# Altium schematic sheet sar20-afbr-s50-array-board.SchDoc
size A3; SheetNumber: 1; SheetTotal: 1
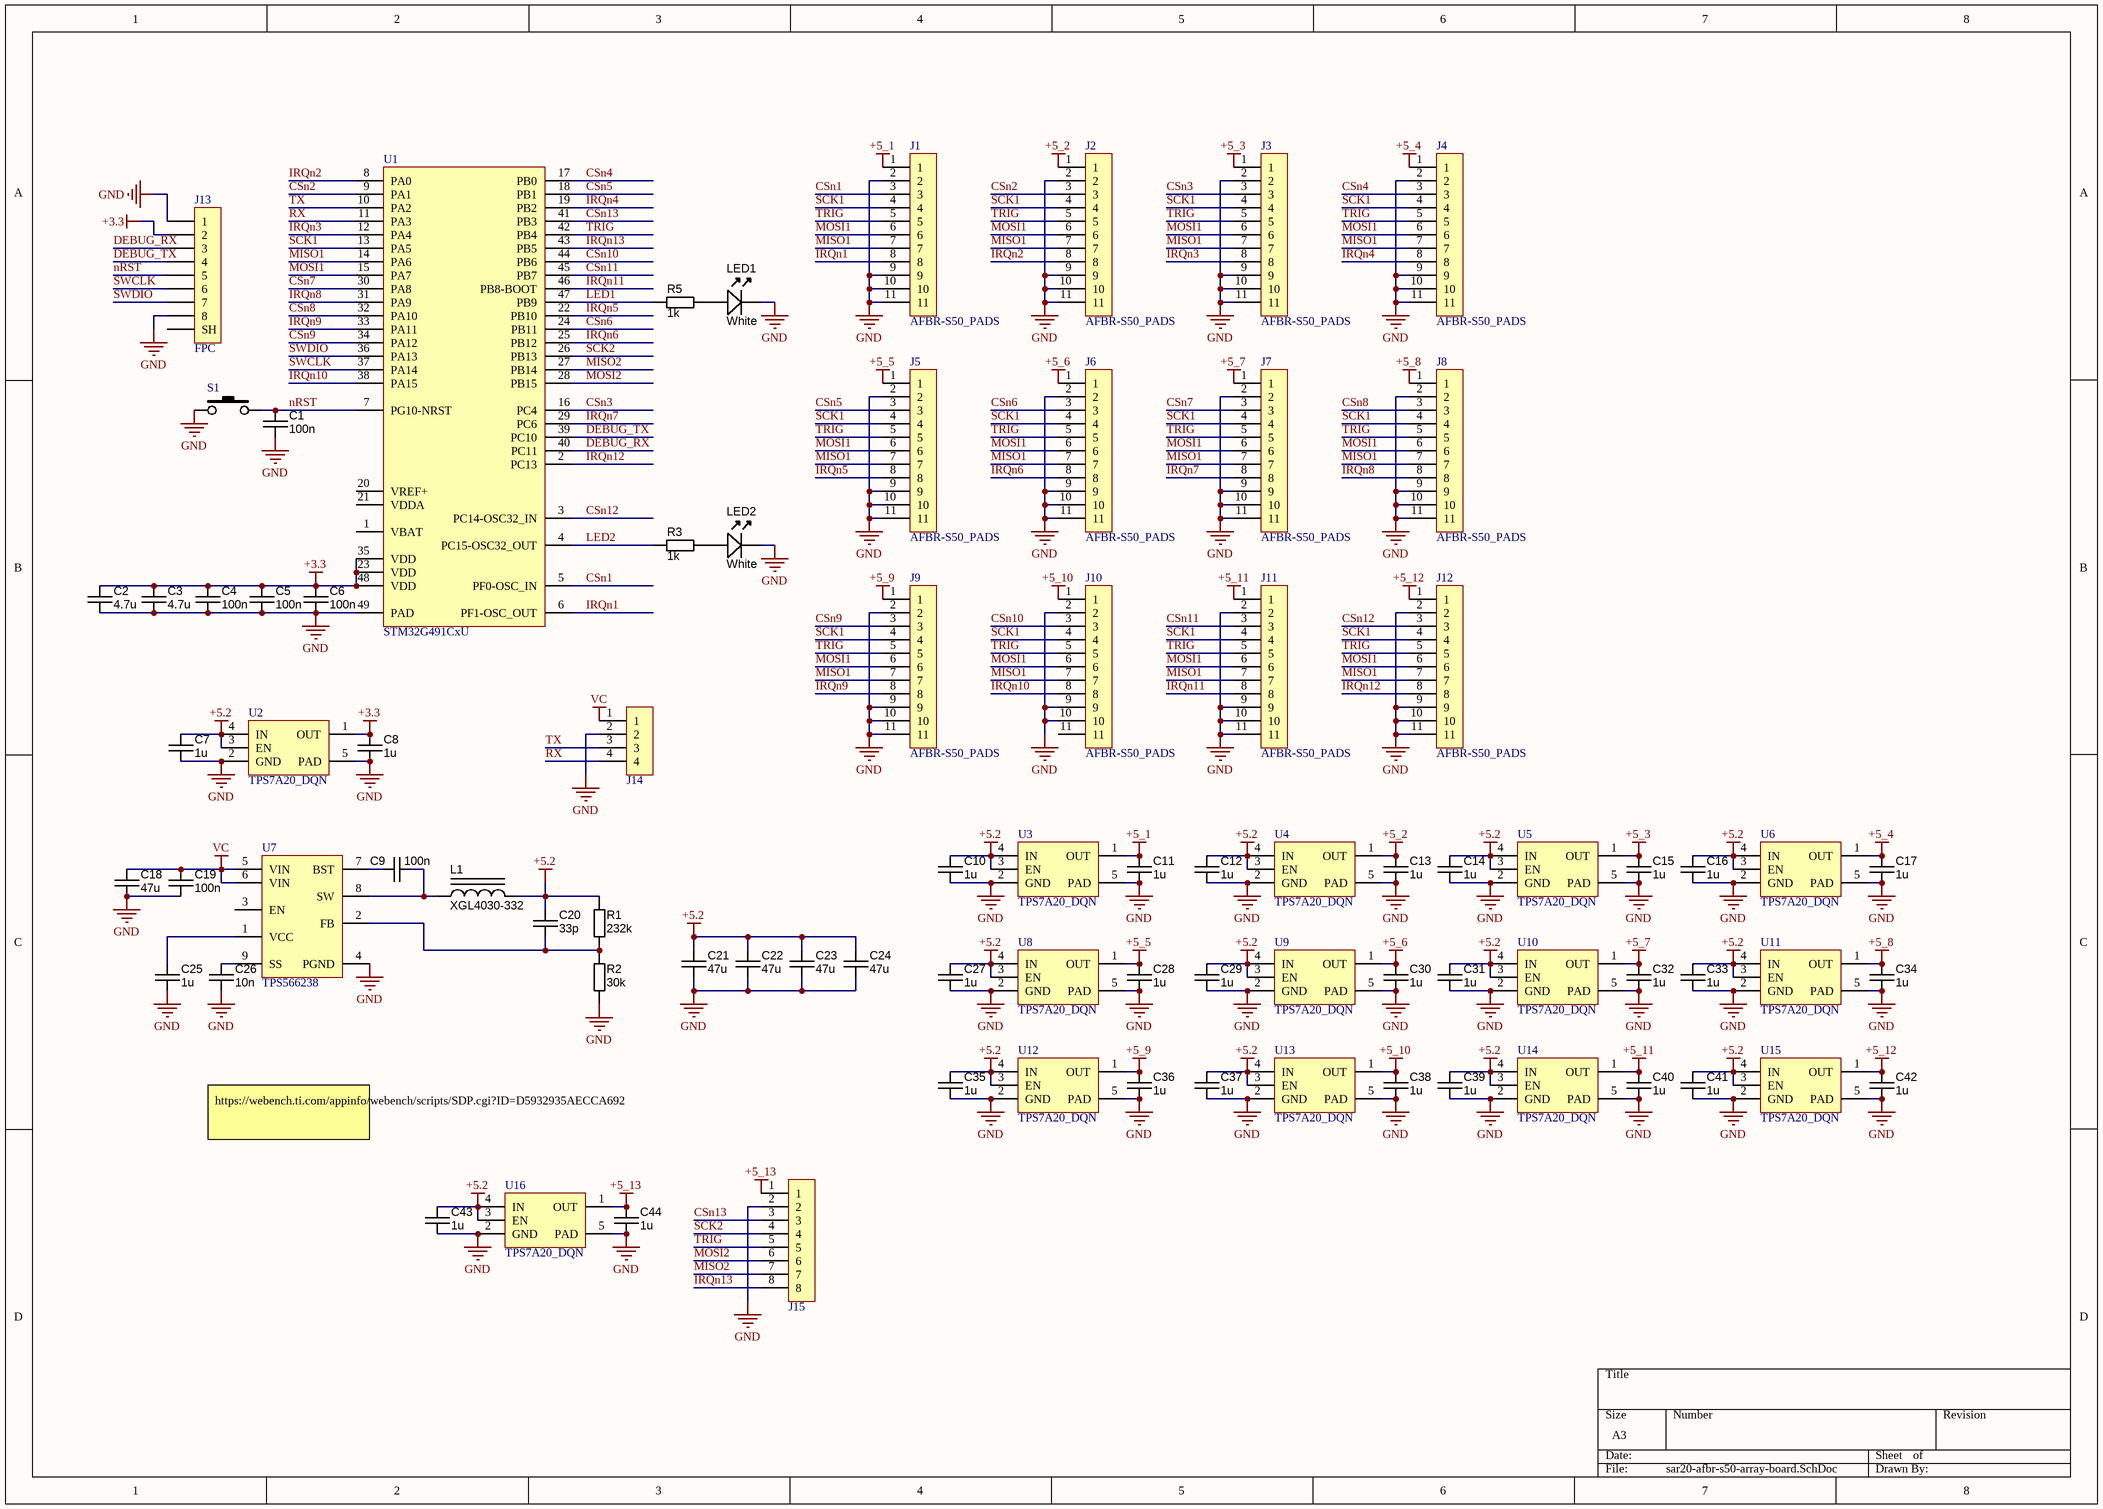
[diagram p0: sar20-afbr-s50-array-board.SchDoc]

## Parts
C1  value 100n  [CAPC0603X04N]  (hidden comment: CAPC_100n_0201)
C2  value 4.7u  [CAPC1608X90N]  (hidden comment: approved sub OK)
C3  value 4.7u  [CAPC1608X90N]  (hidden comment: approved sub OK)
C4  100n  [CAPC1005X55N]
C5  100n  [CAPC1005X55N]
C6  100n  [CAPC1005X55N]
C7  1u  [CAPC1005X55N]
C8  1u  [CAPC1005X55N]
C9  100n  [CAPC1005X55N]
C10  1u  [CAPC1005X55N]
C11  1u  [CAPC1005X55N]
C12  1u  [CAPC1005X55N]
C13  1u  [CAPC1005X55N]
C14  1u  [CAPC1005X55N]
C15  1u  [CAPC1005X55N]
C16  1u  [CAPC1005X55N]
C17  1u  [CAPC1005X55N]
C18  value 47u  [CAPC3216X180N]  (hidden comment: approved sub OK)
C19  100n  [CAPC1005X55N]
C20  33p  [CAPC1005X55N]
C21  value 47u  [CAPC3216X180N]  (hidden comment: approved sub OK)
C22  value 47u  [CAPC3216X180N]  (hidden comment: approved sub OK)
C23  value 47u  [CAPC3216X180N]  (hidden comment: approved sub OK)
C24  value 47u  [CAPC3216X180N]  (hidden comment: approved sub OK)
C25  1u  [CAPC1005X55N]
C26  10n  [CAPC1005X55N]
C27  1u  [CAPC1005X55N]
C28  1u  [CAPC1005X55N]
C29  1u  [CAPC1005X55N]
C30  1u  [CAPC1005X55N]
C31  1u  [CAPC1005X55N]
C32  1u  [CAPC1005X55N]
C33  1u  [CAPC1005X55N]
C34  1u  [CAPC1005X55N]
C35  1u  [CAPC1005X55N]
C36  1u  [CAPC1005X55N]
C37  1u  [CAPC1005X55N]
C38  1u  [CAPC1005X55N]
C39  1u  [CAPC1005X55N]
C40  1u  [CAPC1005X55N]
C41  1u  [CAPC1005X55N]
C42  1u  [CAPC1005X55N]
C43  1u  [CAPC1005X55N]
C44  1u  [CAPC1005X55N]
J1  AFBR-S50_PADS  [AFBR-S50_PADS]
J2  AFBR-S50_PADS  [AFBR-S50_PADS]
J3  AFBR-S50_PADS  [AFBR-S50_PADS]
J4  AFBR-S50_PADS  [AFBR-S50_PADS]
J5  AFBR-S50_PADS  [AFBR-S50_PADS]
J6  AFBR-S50_PADS  [AFBR-S50_PADS]
J7  AFBR-S50_PADS  [AFBR-S50_PADS]
J8  AFBR-S50_PADS  [AFBR-S50_PADS]
J9  AFBR-S50_PADS  [AFBR-S50_PADS]
J10  AFBR-S50_PADS  [AFBR-S50_PADS]
J11  AFBR-S50_PADS  [AFBR-S50_PADS]
J12  AFBR-S50_PADS  [AFBR-S50_PADS]
J13  FPC  [HIROSE-FH19C-8S-0.5SH]
J14  MOLEX_PICOBLADE_530470410  [MOLEX_PICOBLADE_530470410]  (value not drawn)
J15  MOLEX_PICOBLADE_532610871  [MOLEX_PICOBLADE_532610871]  (value not drawn)
L1  XGL4030-332  [XGL4030]
LED1  White  [LED-0603-WHITE]
LED2  White  [LED-0603-WHITE]
R1  value 232k  [RESC1005X40N]  (hidden comment: Thick Film)
R2  value 30k  [RESC1005X40N]  (hidden comment: Thick Film)
R3  value 1k  [RESC1005X40N]  (hidden comment: Thick Film)
R5  value 1k  [RESC1005X40N]  (hidden comment: Thick Film)
S1  PUSHBUTTON  [KMR421NGLFS]  (value not drawn)
U1  STM32G491CxU  [QFN50P700X700X60_HS-49N]
U2  TPS7A20_DQN  [TI_X2SON_DQN0004A]
U3  TPS7A20_DQN  [TI_X2SON_DQN0004A]
U4  TPS7A20_DQN  [TI_X2SON_DQN0004A]
U5  TPS7A20_DQN  [TI_X2SON_DQN0004A]
U6  TPS7A20_DQN  [TI_X2SON_DQN0004A]
U7  TPS566238  [TI_VQFN-HR_RQF0009A]
U8  TPS7A20_DQN  [TI_X2SON_DQN0004A]
U9  TPS7A20_DQN  [TI_X2SON_DQN0004A]
U10  TPS7A20_DQN  [TI_X2SON_DQN0004A]
U11  TPS7A20_DQN  [TI_X2SON_DQN0004A]
U12  TPS7A20_DQN  [TI_X2SON_DQN0004A]
U13  TPS7A20_DQN  [TI_X2SON_DQN0004A]
U14  TPS7A20_DQN  [TI_X2SON_DQN0004A]
U15  TPS7A20_DQN  [TI_X2SON_DQN0004A]
U16  TPS7A20_DQN  [TI_X2SON_DQN0004A]

## Nets
+3.3: C2.1 C3.1 C4.2 C5.2 C6.2 C8.2 J13.2 U1.23(VDD) U1.35(VDD) U1.48(VDD) U2.1(OUT)
+5.2: C7.2 C10.2 C12.2 C14.2 C16.2 C20.2 C21.1 C22.1 C23.1 C24.1 C27.2 C29.2 C31.2 C33.2 C35.2 C37.2 C39.2 C41.2 C43.2 L1.2 R1.2 U2.3(EN) U2.4(IN) U3.3(EN) U3.4(IN) U4.3(EN) U4.4(IN) U5.3(EN) U5.4(IN) U6.3(EN) U6.4(IN) U8.3(EN) U8.4(IN) U9.3(EN) U9.4(IN) U10.3(EN) U10.4(IN) U11.3(EN) U11.4(IN) U12.3(EN) U12.4(IN) U13.3(EN) U13.4(IN) U14.3(EN) U14.4(IN) U15.3(EN) U15.4(IN) U16.3(EN) U16.4(IN)
+5_1: C11.2 J1.1 U3.1(OUT)
+5_2: C13.2 J2.1 U4.1(OUT)
+5_3: C15.2 J3.1 U5.1(OUT)
+5_4: C17.2 J4.1 U6.1(OUT)
+5_5: C28.2 J5.1 U8.1(OUT)
+5_6: C30.2 J6.1 U9.1(OUT)
+5_7: C32.2 J7.1 U10.1(OUT)
+5_8: C34.2 J8.1 U11.1(OUT)
+5_9: C36.2 J9.1 U12.1(OUT)
+5_10: C38.2 J10.1 U13.1(OUT)
+5_11: C40.2 J11.1 U14.1(OUT)
+5_12: C42.2 J12.1 U15.1(OUT)
+5_13: C44.2 J15.1 U16.1(OUT)
GND: C1.1 C2.2 C3.2 C4.1 C5.1 C6.1 C7.1 C8.1 C10.1 C11.1 C12.1 C13.1 C14.1 C15.1 C16.1 C17.1 C18.2 C19.1 C21.2 C22.2 C23.2 C24.2 C25.1 C26.1 C27.1 C28.1 C29.1 C30.1 C31.1 C32.1 C33.1 C34.1 C35.1 C36.1 C37.1 C38.1 C39.1 C40.1 C41.1 C42.1 C43.1 C44.1 J1.2 J1.9 J1.10 J1.11 J2.2 J2.9 J2.10 J2.11 J3.2 J3.9 J3.10 J3.11 J4.2 J4.9 J4.10 J4.11 J5.2 J5.9 J5.10 J5.11 J6.2 J6.9 J6.10 J6.11 J7.2 J7.9 J7.10 J7.11 J8.2 J8.9 J8.10 J8.11 J9.2 J9.9 J9.10 J9.11 J10.2 J10.9 J10.10 J11.2 J11.9 J11.10 J11.11 J12.2 J12.9 J12.10 J12.11 J13.1 J13.8 J14.2 J15.2 LED1.K LED2.K R2.1 S1.1 U1.49(PAD) U2.2(GND) U2.5(PAD) U3.2(GND) U3.5(PAD) U4.2(GND) U4.5(PAD) U5.2(GND) U5.5(PAD) U6.2(GND) U6.5(PAD) U7.4(PGND) U8.2(GND) U8.5(PAD) U9.2(GND) U9.5(PAD) U10.2(GND) U10.5(PAD) U11.2(GND) U11.5(PAD) U12.2(GND) U12.5(PAD) U13.2(GND) U13.5(PAD) U14.2(GND) U14.5(PAD) U15.2(GND) U15.5(PAD) U16.2(GND) U16.5(PAD)
VC: C18.1 C19.2 J14.1 U7.5(VIN) U7.6(VIN)
CSn1: J1.3 U1.5(PF0-OSC_IN)
CSn2: J2.3 U1.9(PA1)
CSn3: J3.3 U1.16(PC4)
CSn4: J4.3 U1.17(PB0)
CSn5: J5.3 U1.18(PB1)
CSn6: J6.3 U1.24(PB11)
CSn7: J7.3 U1.30(PA8)
CSn8: J8.3 U1.32(PA10)
CSn9: J9.3 U1.34(PA12)
CSn10: J10.3 U1.44(PB6)
CSn11: J11.3 U1.45(PB7)
CSn12: J12.3 U1.3(PC14-OSC32_IN)
CSn13: J15.3 U1.41(PB3)
DEBUG_RX: J13.3 U1.40(PC11)
DEBUG_TX: J13.4 U1.39(PC10)
IRQn1: J1.8 U1.6(PF1-OSC_OUT)
IRQn2: J2.8 U1.8(PA0)
IRQn3: J3.8 U1.12(PA4)
IRQn4: J4.8 U1.19(PB2)
IRQn5: J5.8 U1.22(PB10)
IRQn6: J6.8 U1.25(PB12)
IRQn7: J7.8 U1.29(PC6)
IRQn8: J8.8 U1.31(PA9)
IRQn9: J9.8 U1.33(PA11)
IRQn10: J10.8 U1.38(PA15)
IRQn11: J11.8 U1.46(PB8-BOOT)
IRQn12: J12.8 U1.2(PC13)
IRQn13: J15.8 U1.43(PB5)
LED1: R5.1 U1.47(PB9)
LED2: R3.1 U1.4(PC15-OSC32_OUT)
MISO1: J1.7 J2.7 J3.7 J4.7 J5.7 J6.7 J7.7 J8.7 J9.7 J10.7 J11.7 J12.7 U1.14(PA6)
MISO2: J15.7 U1.27(PB14)
MOSI1: J1.6 J2.6 J3.6 J4.6 J5.6 J6.6 J7.6 J8.6 J9.6 J10.6 J11.6 J12.6 U1.15(PA7)
MOSI2: J15.6 U1.28(PB15)
nRST: C1.2 J13.5 S1.2 U1.7(PG10-NRST)
RX: J14.4 U1.11(PA3)
SCK1: J1.4 J2.4 J3.4 J4.4 J5.4 J6.4 J7.4 J8.4 J9.4 J10.4 J11.4 J12.4 U1.13(PA5)
SCK2: J15.4 U1.26(PB13)
SWCLK: J13.6 U1.37(PA14)
SWDIO: J13.7 U1.36(PA13)
TRIG: J1.5 J2.5 J3.5 J4.5 J5.5 J6.5 J7.5 J8.5 J9.5 J10.5 J11.5 J12.5 J15.5 U1.42(PB4)
TX: J14.3 U1.10(PA2)
NetC9_1: C9.1 U7.7(BST)
NetC9_2: C9.2 L1.1 U7.8(SW)
NetC20_1: C20.1 R1.1 R2.2 U7.2(FB)
NetC25_2: C25.2 U7.1(VCC)
NetC26_2: C26.2 U7.9(SS)
NetLED1_A: LED1.A R5.2
NetLED2_A: LED2.A R3.2

Not connected (* = marked no-connect by the designer): J10 11; J13 SH; U1 1(VBAT) 20(VREF+) 21(VDDA); U7 3(EN)

## Notes on the sheet
- https://webench.ti.com/appinfo/webench/scripts/SDP.cgi?ID=D5932935AECCA692

## Library data of the parts
C2 C3 = CAPC_2u2_0603_10V_10%: Capacitor SMD Cer 2.2uF 10% 10V X5R 0603; Manufacturer 1: AVX Corporation; Manufacturer Part Number 1: 0603ZD225KAT2A; Ratings: 10V; X5R; Material: ceramic; SCDType: spec; Package / Case: 0603 (1608 metric); Tolerance: ±10%; Supplier 1: Digi-Key; Supplier Part Number 1: 478-6212-1-ND; ComponentLink1URL: http://www.avx.com/docs/Catalogs/cx5r.pdf; ComponentLink1Description: http://www.avx.com/docs/Catalogs/cx5r.pdf
C4-C17 C19 C20 C25-C44 = CAPC_100n_0402_X5R_16V_10%: Capacitor SMD Cer 100nF 10% 16V X5R 0402; Manufacturer 1: AVX Corporation; Manufacturer Part Number 1: 0402YD104KAT2A; Ratings: 16V; X5R; SCDType: spec; Tolerance: ±10%; Operating Temperature: -55°C ~ 125°C; Package / Case: 0402 (1005 Metric); Size / Dimension: 0.039" L x 0.020" W (1.00mm x 0.50mm); Supplier 1: Digi-Key; Supplier Part Number 1: 478-1126-1-ND; ComponentLink1URL: http://www.avx.com/docs/Catalogs/cx5r.pdf; ComponentLink1Description: http://www.avx.com/docs/Catalogs/cx5r.pdf; Supplier 2: Digi-Key; Supplier Part Number 2: 311-1347-1-ND; Manufacturer 2: Yageo; Manufacturer Part Number 2: CC0402KRX5R7BB104; ComponentLink2URL: http://www.yageo.com/documents/recent/UPY-GPHC_X5R_4V-to-50V_12.pdf; ComponentLink2Description: http://www.yageo.com/documents/recent/UPY-GPHC_X5R_4V-to-50V_12.pdf
  C4-C6 C9 C19: Value: 100n
  C7 C8 C10-C17 C25 C27-C44: Value: 1u
  C20: Value: 33p
  C26: Value: 10n
C18 C21-C24 = CAPC_10u_1206_16V: Capacitor SMD Cer 10uF 10% 16V X7R 1206; Manufacturer 1: Kemet; Manufacturer Part Number 1: C1206C106K4RACTU; Ratings: 16V; X7R; Material: ceramic; SCDType: spec; Package / Case: 1206 (3216 metric); Tolerance: ±10%; Supplier 1: Digi-Key; Supplier Part Number 1: 399-3525-1-ND
J13 = FPC-CONNECTOR-8
L1 = XGL4030
LED1 LED2 = LED_SMD_White_0603_Bright: LED 0603 SMD Bright White 8700K; Manufacturer 1: Lite-On Inc; Manufacturer Part Number 1: LTW-C193TS5; Material: InGaN; Ratings: Ultra Bright; 8700K; Millicandela Rating: 230mcd; Voltage - Forward (Vf) Typ: 3.3V; Viewing Angle: 120°; Lens Type: Clear, Tinted; Lens Style/Size: Rectangle with Flat Top, 0.8mm x 1.1mm; Voltage - Forward (Vf) @ 10mA: 3.0V; SCDType: source; Package / Case: 0603 (1608 metric); Supplier 1: Digi-Key; Supplier Part Number 1: 160-1721-1-ND; Supplier 2: Digi-Key; Supplier Part Number 2: APT1608QWF/D-ND; Manufacturer 2: Kingbright Corp; Manufacturer Part Number 2: APT1608QWF/D; Color: White; Size / Dimension: 1.60mm L x 0.80mm W; Mounting Type: Surface Mount; Luminous Flux @ Current - Test: -; ComponentLink2URL: http://www.kingbrightusa.com/images/catalog/SPEC/APT1608QWF-D.pdf; ComponentLink2Description: http://www.kingbrightusa.com/images/catalog/SPEC/APT1608QWF-D.pdf; ComponentLink1URL: http://media.digikey.com/pdf/Data%20Sheets/Lite-On%20PDFs/LTW-C193TS5.pdf; ComponentLink1Description: http://media.digikey.com/pdf/Data%20Sheets/Lite-On%20PDFs/LTW-C193TS5.pdf
R1 R2 = RES_10K_0402_1%: Resistor SMD chip 10k Ohm 0.063W 1% 0402; Manufacturer 1: Vishay Dale; Manufacturer Part Number 1: CRCW040210K0FKED; Ratings: 1/16 W; SCDType: spec; Package / Case: 0402 (1005 Metric); Manufacturer 2: Yageo; Manufacturer Part Number 2: RC0402FR-0710KL; Supplier 1: Digi-Key; Supplier Part Number 1: 541-10.0KLCT-ND; ComponentLink1URL: http://www.vishay.com/doc?20035; ComponentLink1Description: http://www.vishay.com/doc?20035; Supplier 2: Digi-Key; Supplier Part Number 2: 311-10.0KLRCT-ND; ComponentLink2URL: http://www.yageo.com/documents/recent/PYu-RC0402_51_RoHS_L_6.pdf; ComponentLink2Description: http://www.yageo.com/documents/recent/PYu-RC0402_51_RoHS_L_6.pdf; Tolerance: ±1%
R3 R5 = RES_1K_0402_5%: Resistor SMD chip 1k Ohm 0.063W 5% 0402; Manufacturer 1: Yageo; Manufacturer Part Number 1: RC0402JR-071KL; Ratings: 1/16 W; SCDType: spec; Package / Case: 0402 (1005 Metric); Tolerance: ±5%; Supplier 1: Digi-Key; Supplier Part Number 1: 311-1.0KJRCT-ND; RoHS 1: RoHS Compliant; ComponentLink1URL: http://www.yageo.com/documents/recent/PYu-RC0402_51_RoHS_L_6.pdf; ComponentLink1Description: http://www.yageo.com/documents/recent/PYu-RC0402_51_RoHS_L_6.pdf; Supplier 2: Digi-Key; Supplier Part Number 2: 541-1.0KJCT-ND; Manufacturer 2: Vishay Dale; Manufacturer Part Number 2: CRCW04021K00JNED; RoHS 2: RoHS Compliant; ComponentLink2URL: http://www.vishay.com/doc?20035; ComponentLink2Description: http://www.vishay.com/doc?20035; Supplier 3: Digi-Key; Supplier Part Number 3: 1276-4376-1-ND; Manufacturer 3: Samsung Electro-Mechanics America, Inc; Manufacturer Part Number 3: RC1005J102CS; RoHS 3: RoHS Compliant; ComponentLink3URL: http://www.samsungsem.com/servlet/FileDownload?filename=productcatalog/pdf/Chip_Resistor.pdf; ComponentLink3Description: http://www.samsungsem.com/servlet/FileDownload?filename=productcatalog/pdf/Chip_Resistor.pdf; Supplier 4: Digi-Key; Supplier Part Number 4: RHM1.0KCECT-ND; Manufacturer 4: Rohm Semiconductor; Manufacturer Part Number 4: MCR01MRTJ102; RoHS 4: RoHS Compliant; ComponentLink4URL: http://rohmfs.rohm.com/en/products/databook/datasheet/passive/resistor/chip_resistor/mcr_g.pdf; ComponentLink4Description: http://rohmfs.rohm.com/en/products/databook/datasheet/passive/resistor/chip_resistor/mcr_g.pdf; Supplier 5: Digi-Key; Supplier Part Number 5: P1.0KJCT-ND; Manufacturer 5: Panasonic Electronic Components; Manufacturer Part Number 5: ERJ-2GEJ102X; RoHS 5: RoHS Compliant; ComponentLink5URL: http://industrial.panasonic.com/www-cgi/jvcr13pz.cgi?E+PZ+3+AOA0001+ERJ2GEJ102X+7+WW; ComponentLink5Description: http://industrial.panasonic.com/www-cgi/jvcr13pz.cgi?E+PZ+3+AOA0001+ERJ2GEJ102X+7+WW